# EAGLE design HFT-Module-Arduino_1V0 (EAGLE 7.7.0)

## Sheet 1 of 4: Connectors
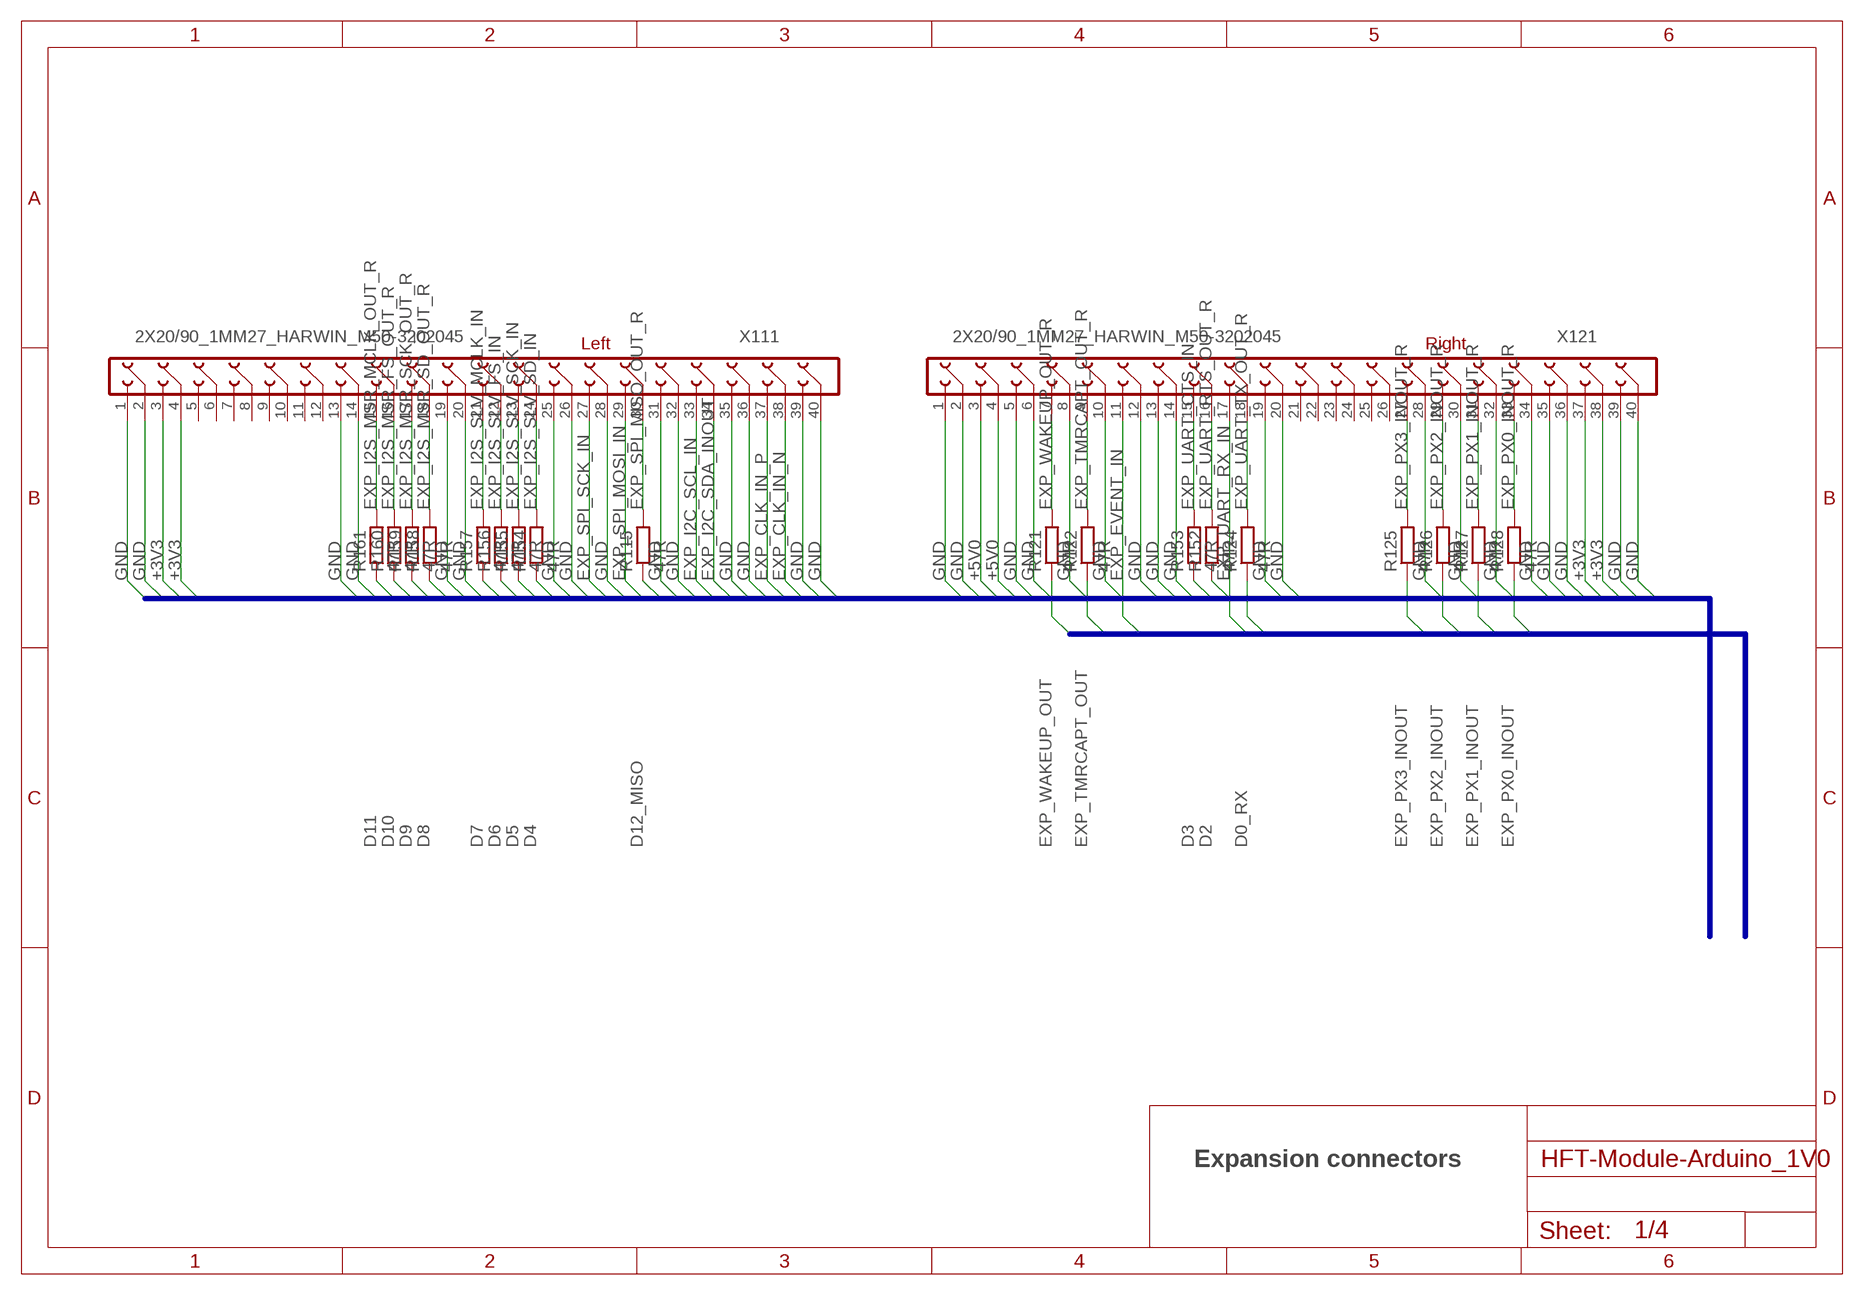
[diagram p0: schematic, sheet 1]

### Parts
R115  47R  R-EU_R0805  [R0805]
R121  47R  R-EU_R0805  [R0805]
R122  47R  R-EU_R0805  [R0805]
R124  47R  R-EU_R0805  [R0805]
R125  47R  R-EU_R0805  [R0805]
R126  47R  R-EU_R0805  [R0805]
R127  47R  R-EU_R0805  [R0805]
R128  47R  R-EU_R0805  [R0805]
R152  47R  R-EU_R0805  [R0805]
R153  47R  R-EU_R0805  [R0805]
R154  47R  R-EU_R0805  [R0805]
R155  47R  R-EU_R0805  [R0805]
R156  47R  R-EU_R0805  [R0805]
R157  47R  R-EU_R0805  [R0805]
R158  47R  R-EU_R0805  [R0805]
R159  47R  R-EU_R0805  [R0805]
R160  47R  R-EU_R0805  [R0805]
R161  47R  R-EU_R0805  [R0805]
X111  2X20/90_1MM27_HARWIN_M50-3202045  [2X20/90_1MM27_HARWIN_M50-3202045]
X121  2X20/90_1MM27_HARWIN_M50-3202045  [2X20/90_1MM27_HARWIN_M50-3202045]

### Nets
+3V3: X111.3 X111.4 X121.37 X121.38 ; also sheet 2,3
+5V0 [pwrA5]: X121.3 X121.4 ; also sheet 2,3
D0_RX: R124.1 ; also sheet 3
D2: R152.1 ; also sheet 2
D3: R153.1 ; also sheet 2
D4: R154.1 ; also sheet 3
D5: R155.1 ; also sheet 3
D6: R156.1 ; also sheet 3
D7: R157.1 ; also sheet 3
D8: R158.1 ; also sheet 3
D9: R159.1 ; also sheet 3
D10: R160.1 ; also sheet 3
D11: R161.1 ; also sheet 2
D12_MISO: R115.1 ; also sheet 3
EXP_CLK_IN_N: X111.38
EXP_CLK_IN_P: X111.37
EXP_EVENT_IN: X121.11 ; also sheet 2
EXP_I2C_SCL_IN: X111.33 ; also sheet 2,3
EXP_I2C_SDA_INOUT: X111.34 ; also sheet 2,3
EXP_I2S_MSR_FS_OUT_R: R160.2 X111.16
EXP_I2S_MSR_MCLK_OUT_R: R161.2 X111.15
EXP_I2S_MSR_SCK_OUT_R: R159.2 X111.17
EXP_I2S_MSR_SD_OUT_R: R158.2 X111.18
EXP_I2S_SLV_FS_IN: R156.2 X111.22
EXP_I2S_SLV_MCLK_IN: R157.2 X111.21
EXP_I2S_SLV_SCK_IN: R155.2 X111.23
EXP_I2S_SLV_SD_IN: R154.2 X111.24
EXP_PX0_INOUT: R128.1 ; also sheet 3
EXP_PX0_INOUT_R: R128.2 X121.33
EXP_PX1_INOUT: R127.1 ; also sheet 3
EXP_PX1_INOUT_R: R127.2 X121.31
EXP_PX2_INOUT: R126.1 ; also sheet 3
EXP_PX2_INOUT_R: R126.2 X121.29
EXP_PX3_INOUT: R125.1 ; also sheet 3
EXP_PX3_INOUT_R: R125.2 X121.27
EXP_SPI_MISO_OUT_R: R115.2 X111.30
EXP_SPI_MOSI_IN: X111.29 ; also sheet 3
EXP_SPI_SCK_IN: X111.27 ; also sheet 3
EXP_TMRCAPT_OUT: R122.1 ; also sheet 2
EXP_TMRCAPT_OUT_R: R122.2 X121.9
EXP_UART_CTS_IN: R153.2 X121.15
EXP_UART_RTS_OUT_R: R152.2 X121.16
EXP_UART_RX_IN: X121.17 ; also sheet 3
EXP_UART_TX_OUT_R: R124.2 X121.18
EXP_WAKEUP_OUT: R121.1 ; also sheet 2
EXP_WAKEUP_OUT_R: R121.2 X121.7
GND: X111.1 X111.2 X111.13 X111.14 X111.19 X111.20 X111.25 X111.26 X111.28 X111.31 X111.32 X111.35 X111.36 X111.39 X111.40 X121.1 X121.2 X121.5 X121.6 X121.8 X121.10 X121.12 X121.13 X121.14 X121.19 X121.20 X121.28 X121.30 X121.32 X121.34 X121.35 X121.36 X121.39 X121.40 ; also sheet 2,3,4
Unconnected: X111.5 X111.6 X111.7 X111.8 X111.9 X111.10 X111.11 X111.12 X121.21 X121.22 X121.23 X121.24 X121.25 X121.26

### Buses
EXP_WAKEUP_OUT,EXP_TMRCAPT_OUT,EXP_EVENT_IN,EXP_UART_TX_OUT,EXP_UART_RX_IN,EXP_UART_CTS_IN,EXP_UART_RTS_OUT,EXP_PX0_INOUT,EXP_PX1_INOUT,EXP_PX2_INOUT,EXP_PX3_INOUT
GND,+3V3,+5V0,EXP_CLK_IN_P,EXP_CLK_IN_N,EXP_I2C_SCL_IN,EXP_I2C_SDA_INOUT,EXP_SPI_SCK_IN,EXP_SPI_MOSI_IN,EXP_SPI_MISO_OUT,EXP_I2S_SLV_SCK_IN,EXP_I2S_SLV_SD_IN,EXP_I2S_SLV_MCLK_IN,EXP_I2S_SLV_FS_IN,EXP_I2S_MSR_SCK_OUT,EXP_I2S_MSR_SD_OUT,EXP_I2S_MSR_MCLK_OUT,EXP_I2S_MSR_FS_OUT,D[2..11]

### Notes on the sheet
- Left | Right
- Expansion connectors

## Sheet 2 of 4: Jumper field
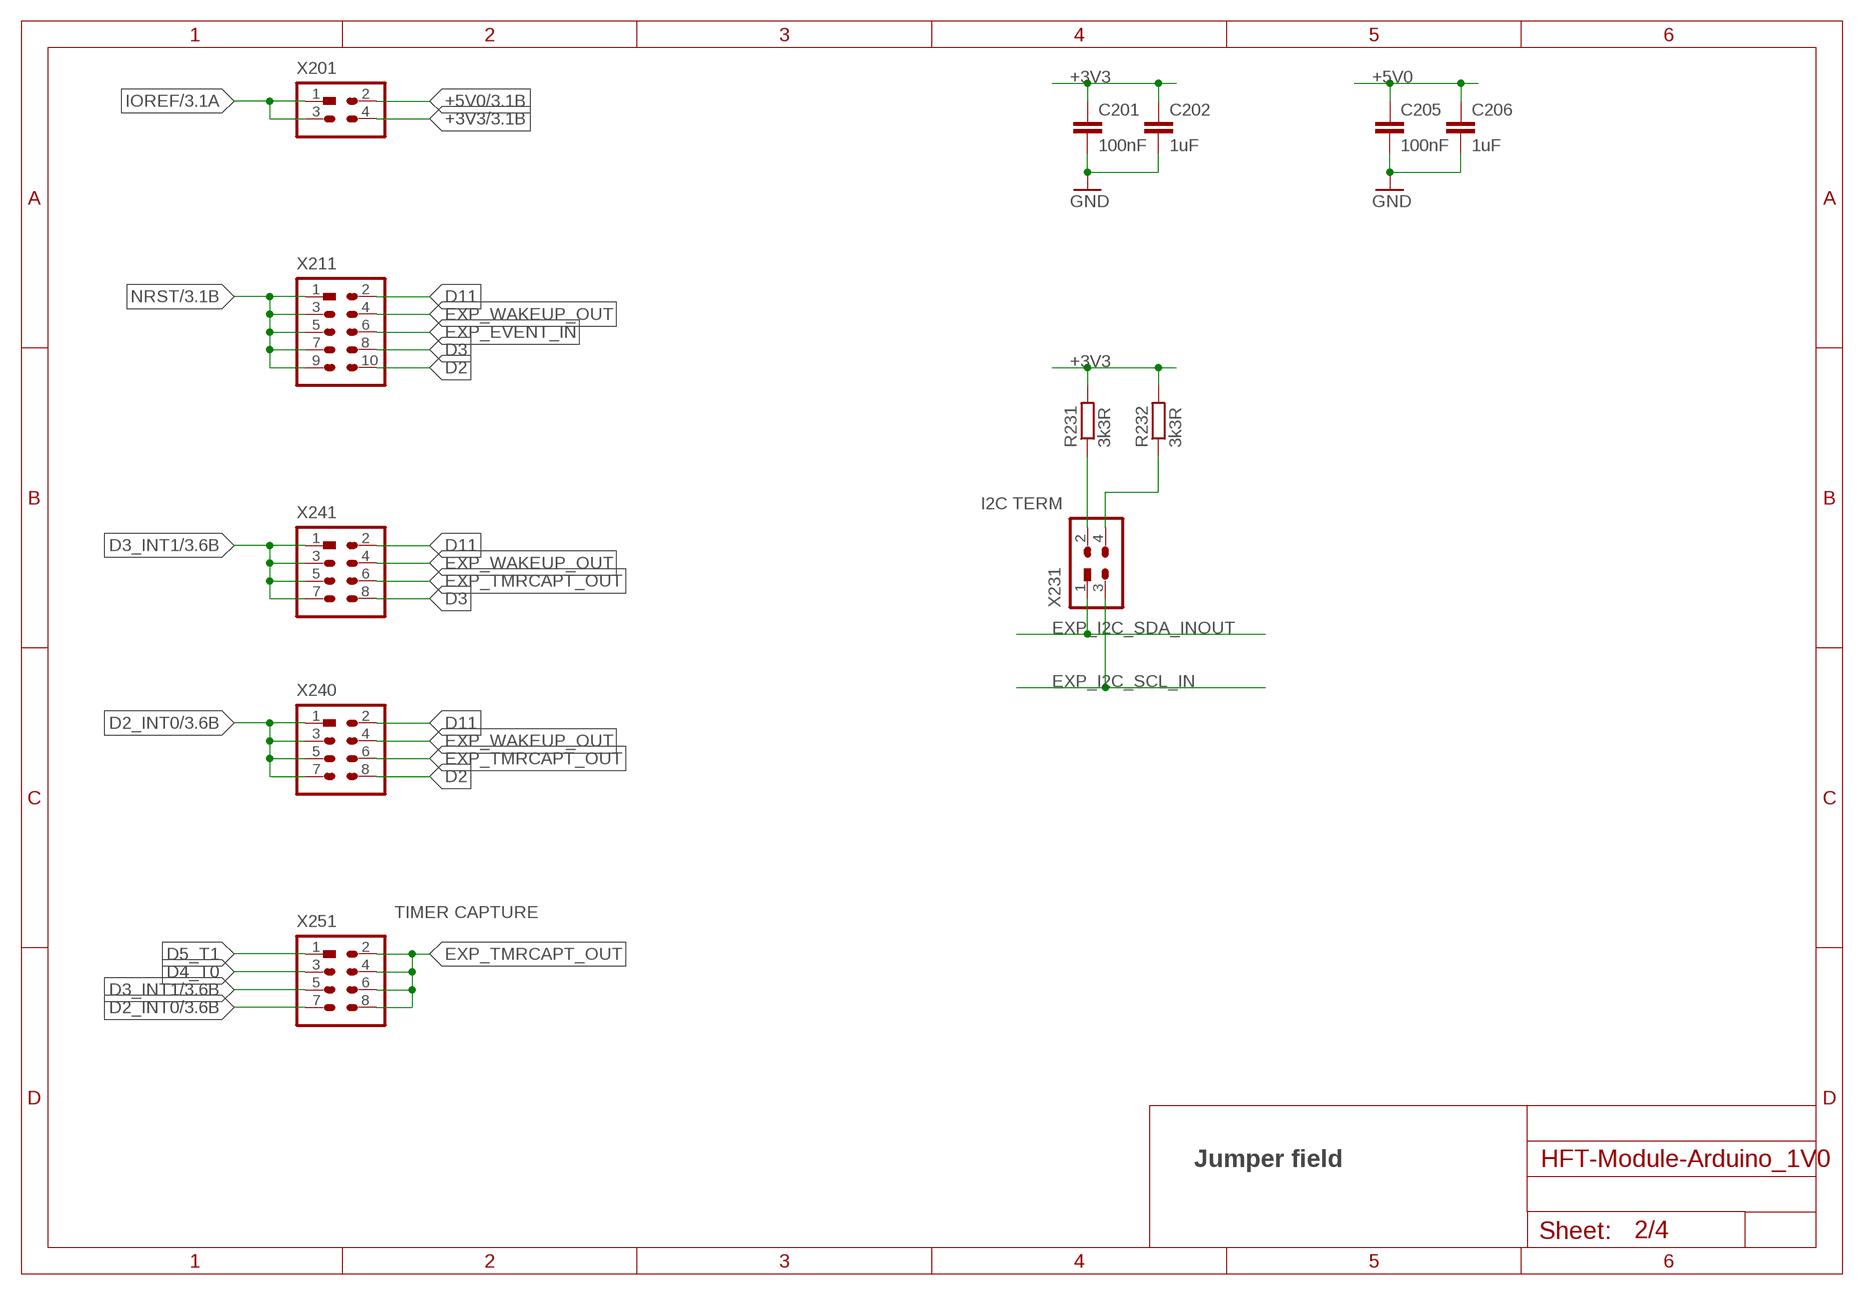
[diagram p1: schematic, sheet 2]

### Parts
C201  100nF  C-EUC0805  [C0805]
C202  1uF  C-EUC0805  [C0805]
C205  100nF  C-EUC0805  [C0805]
C206  1uF  C-EUC0805  [C0805]
R231  3k3R  R-EU_R0805  [R0805]
R232  3k3R  R-EU_R0805  [R0805]
X201  HEADER-2X2  [2X02]
X211  HEADER-2X5  [2X05]
X231  HEADER-2X2  [2X02]
X240  HEADER-2X4  [2X04]
X241  HEADER-2X4  [2X04]
X251  HEADER-2X4  [2X04]

### Nets
+3V3: C201.1 C202.1 R231.2 R232.2 X201.4 ; also sheet 1,3
+5V0 [pwrA5]: C205.1 C206.1 X201.2 ; also sheet 1,3
D2: X211.10 X240.8 ; also sheet 1
D2_INT0: X240.1 X240.3 X240.5 X240.7 X251.7 ; also sheet 3
D3: X211.8 X241.8 ; also sheet 1
D3_INT1: X241.1 X241.3 X241.5 X241.7 X251.5 ; also sheet 3
D4_T0: X251.3 ; also sheet 3
D5_T1: X251.1 ; also sheet 3
D11: X211.2 X240.2 X241.2 ; also sheet 1
EXP_EVENT_IN: X211.6 ; also sheet 1
EXP_I2C_SCL_IN: X231.3 ; also sheet 1,3
EXP_I2C_SDA_INOUT: X231.1 ; also sheet 1,3
EXP_TMRCAPT_OUT: X240.6 X241.6 X251.2 X251.4 X251.6 X251.8 ; also sheet 1
EXP_WAKEUP_OUT: X211.4 X240.4 X241.4 ; also sheet 1
GND: C201.2 C202.2 C205.2 C206.2 ; also sheet 1,3,4
IOREF: X201.1 X201.3 ; also sheet 3
NRST: X211.1 X211.3 X211.5 X211.7 X211.9 ; also sheet 3
SCL_TERM: R232.1 X231.4
SDA_TERM: R231.1 X231.2

### Notes on the sheet
- I2C TERM
- TIMER CAPTURE
- Jumper field

## Sheet 3 of 4: Arduino sockets
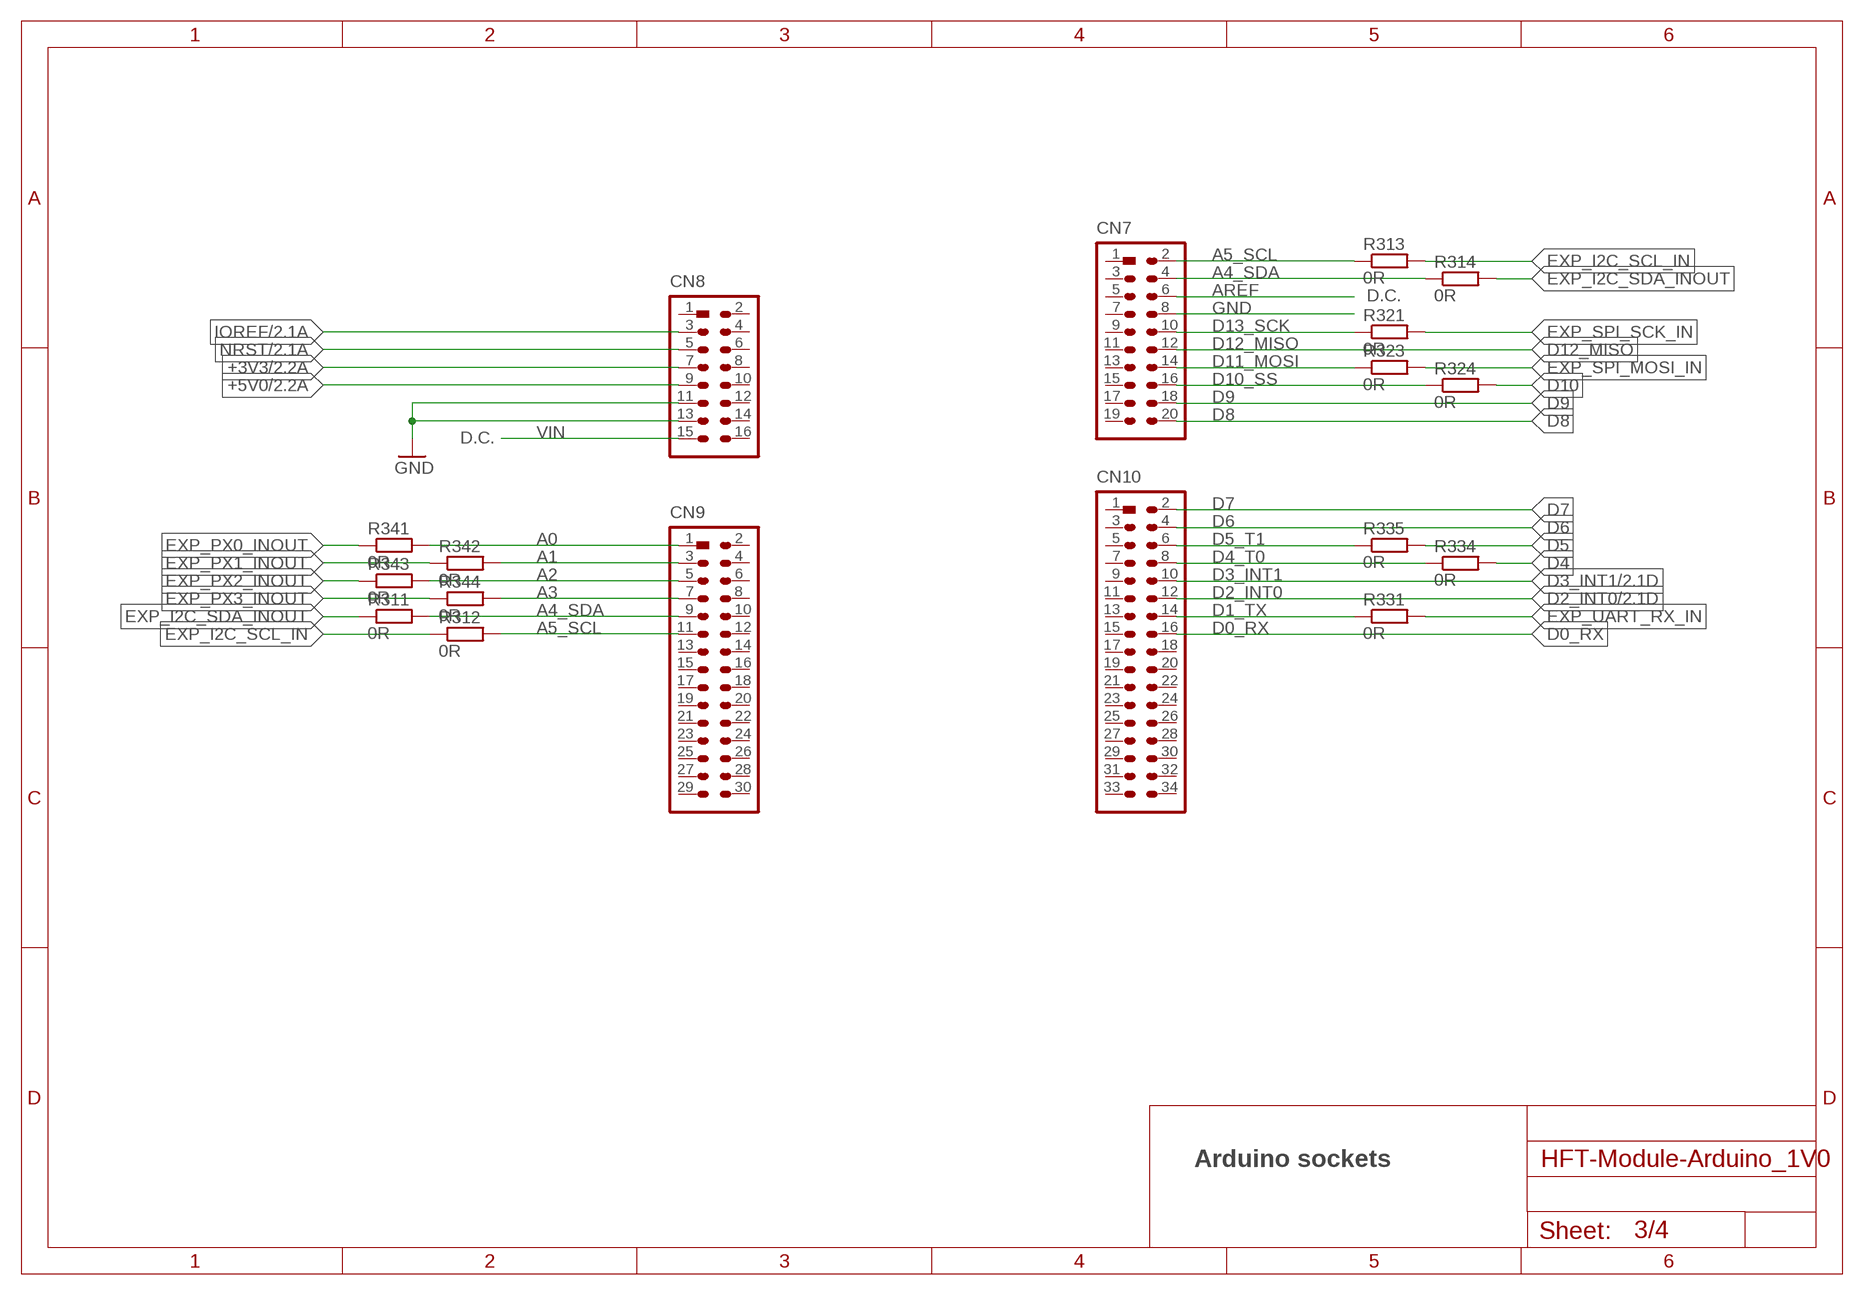
[diagram p2: schematic, sheet 3]

### Parts
CN7  HEADER-2X10  [2X10]
CN8  HEADER-2X8  [2X08]
CN9  HEADER-2X15  [2X15]
CN10  HEADER-2X17  [2X17]
R311  0R  R-EU_R0805  [R0805]
R312  0R  R-EU_R0805  [R0805]
R313  0R  R-EU_R0805  [R0805]
R314  0R  R-EU_R0805  [R0805]
R321  0R  R-EU_R0805  [R0805]
R323  0R  R-EU_R0805  [R0805]
R324  0R  R-EU_R0805  [R0805]
R331  0R  R-EU_R0805  [R0805]
R334  0R  R-EU_R0805  [R0805]
R335  0R  R-EU_R0805  [R0805]
R341  0R  R-EU_R0805  [R0805]
R342  0R  R-EU_R0805  [R0805]
R343  0R  R-EU_R0805  [R0805]
R344  0R  R-EU_R0805  [R0805]

### Nets
+3V3: CN8.7 ; also sheet 1,2
+5V0 [pwrA5]: CN8.9 ; also sheet 1,2
A0: CN9.1 R341.2
A1: CN9.3 R342.2
A2: CN9.5 R343.2
A3: CN9.7 R344.2
A4_SDA: CN7.4 CN9.9 R311.2 R314.1
A5_SCL: CN7.2 CN9.11 R312.2 R313.1
AREF: CN7.6
D0_RX: CN10.16 ; also sheet 1
D1_TX: CN10.14 R331.1
D2_INT0: CN10.12 ; also sheet 2
D3_INT1: CN10.10 ; also sheet 2
D4: R334.2 ; also sheet 1
D4_T0: CN10.8 R334.1 ; also sheet 2
D5: R335.2 ; also sheet 1
D5_T1: CN10.6 R335.1 ; also sheet 2
D6: CN10.4 ; also sheet 1
D7: CN10.2 ; also sheet 1
D8: CN7.20 ; also sheet 1
D9: CN7.18 ; also sheet 1
D10: R324.2 ; also sheet 1
D10_SS: CN7.16 R324.1
D11_MOSI: CN7.14 R323.1
D12_MISO: CN7.12 ; also sheet 1
D13_SCK: CN7.10 R321.1
EXP_I2C_SCL_IN: R312.1 R313.2 ; also sheet 1,2
EXP_I2C_SDA_INOUT: R311.1 R314.2 ; also sheet 1,2
EXP_PX0_INOUT: R341.1 ; also sheet 1
EXP_PX1_INOUT: R342.1 ; also sheet 1
EXP_PX2_INOUT: R343.1 ; also sheet 1
EXP_PX3_INOUT: R344.1 ; also sheet 1
EXP_SPI_MOSI_IN: R323.2 ; also sheet 1
EXP_SPI_SCK_IN: R321.2 ; also sheet 1
EXP_UART_RX_IN: R331.2 ; also sheet 1
GND: CN7.8 CN8.11 CN8.13 ; also sheet 1,2,4
IOREF: CN8.3 ; also sheet 2
NRST: CN8.5 ; also sheet 2
VIN: CN8.15
Unconnected: CN7.1 CN7.3 CN7.5 CN7.7 CN7.9 CN7.11 CN7.13 CN7.15 CN7.17 CN7.19 CN8.1 CN8.2 CN8.4 CN8.6 CN8.8 CN8.10 CN8.12 CN8.14 CN8.16 CN9.2 CN9.4 CN9.6 CN9.8 CN9.10 CN9.12 CN9.13 CN9.14 CN9.15 CN9.16 CN9.17 CN9.18 CN9.19 CN9.20 CN9.21 CN9.22 CN9.23 CN9.24 CN9.25 CN9.26 CN9.27 CN9.28 CN9.29 CN9.30 CN10.1 CN10.3 CN10.5 CN10.7 CN10.9 CN10.11 CN10.13 CN10.15 CN10.17 CN10.18 CN10.19 CN10.20 CN10.21 CN10.22 CN10.23 CN10.24 CN10.25 CN10.26 CN10.27 CN10.28 CN10.29 CN10.30 CN10.31 CN10.32 CN10.33 CN10.34

### Notes on the sheet
- D.C.
- D.C.
- Arduino sockets

## Sheet 4 of 4: Holes
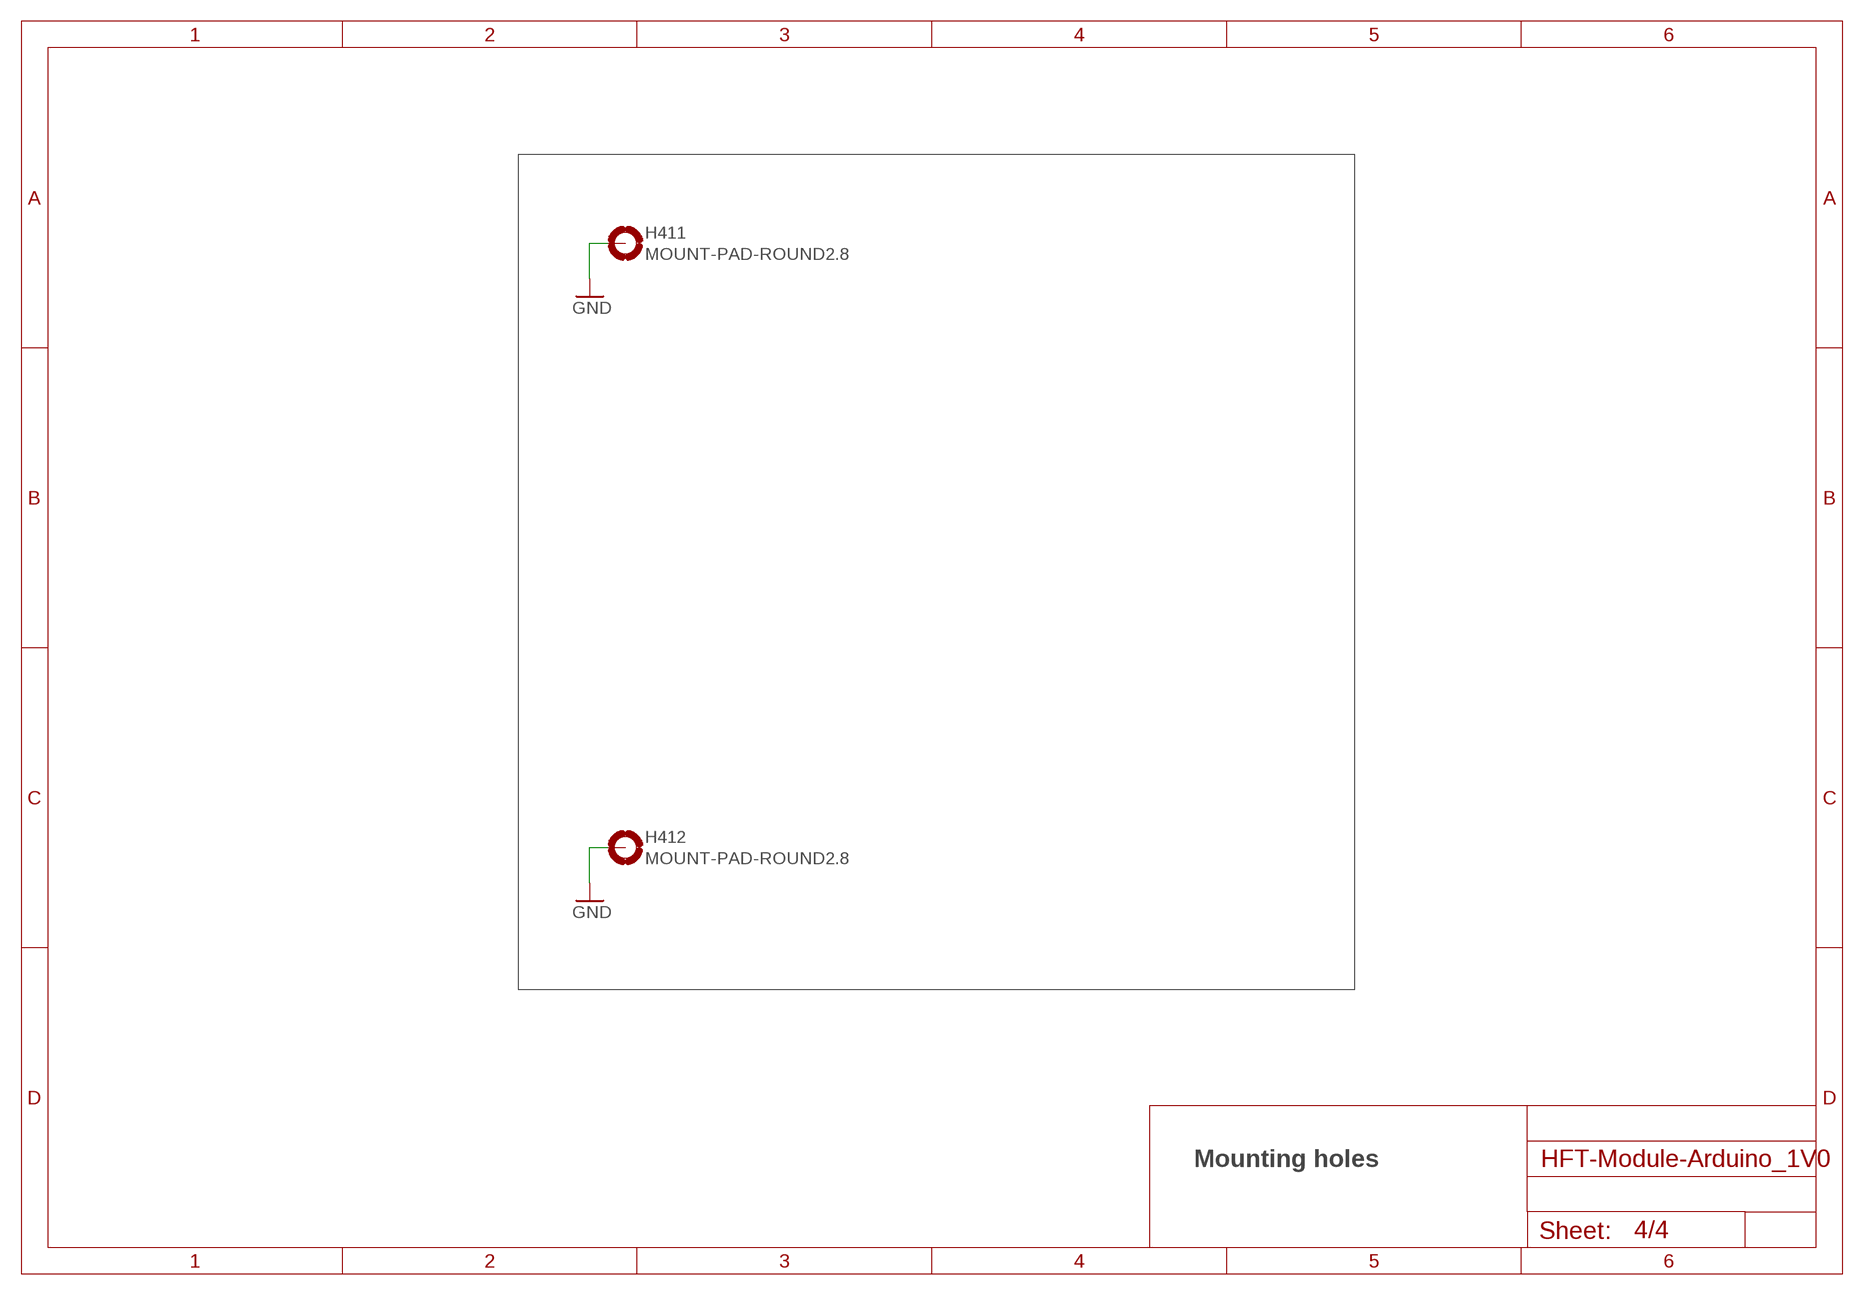
[diagram p3: schematic, sheet 4]

### Parts
H411  MOUNT-PAD-ROUND2.8  [2,8-PAD]
H412  MOUNT-PAD-ROUND2.8  [2,8-PAD]

### Nets
GND: H411.B2,8(MOUNT) H412.B2,8(MOUNT) ; also sheet 1,2,3

### Notes on the sheet
- Mounting holes

## Library data of the parts
C201 C202 C205 C206 = rcl:C-EU: CAPACITOR, European symbol
CN7 = df4iah_connector:HEADER-2X10: Header 2X10 2.54mm
CN8 = df4iah_connector:HEADER-2X8: Header 2X8 2.54mm
CN9 = df4iah_connector:HEADER-2X15: Header 2X15 2.54mm
CN10 = df4iah_connector:HEADER-2X17: Header 2X17 2.54mm
H411 H412 = holes:MOUNT-PAD-ROUND: MOUNTING PAD, round
R115 R121 R122 R124-R128 R152-R161 R231 R232 R311-R314 R321 R323 R324 R331 R334 R335 R341-R344 = rcl:R-EU_: RESISTOR, European symbol
X111 X121 = df4iah_connector:2X20/90_1MM27_HARWIN_M50-3202045: Header 20X2 1.27mm M50-3202045 Archer, 90°
X201 X231 = df4iah_connector:HEADER-2X2: Header 2X2 2.54mm
X211 = df4iah_connector:HEADER-2X5: Header 2X5 2.54mm
X240 X241 X251 = df4iah_connector:HEADER-2X4: Header 2X4 2.54mm

## Net classes
1 pwr_relay: width 1.5 mm, clearance 0.5 mm
2 pwr_ttl: width 0.75 mm, clearance 0.5 mm
4 pwrA5: width 0.4 mm
7 +3V3: clearance 0.5 mm
8 GND: clearance 0.5 mm

## Board
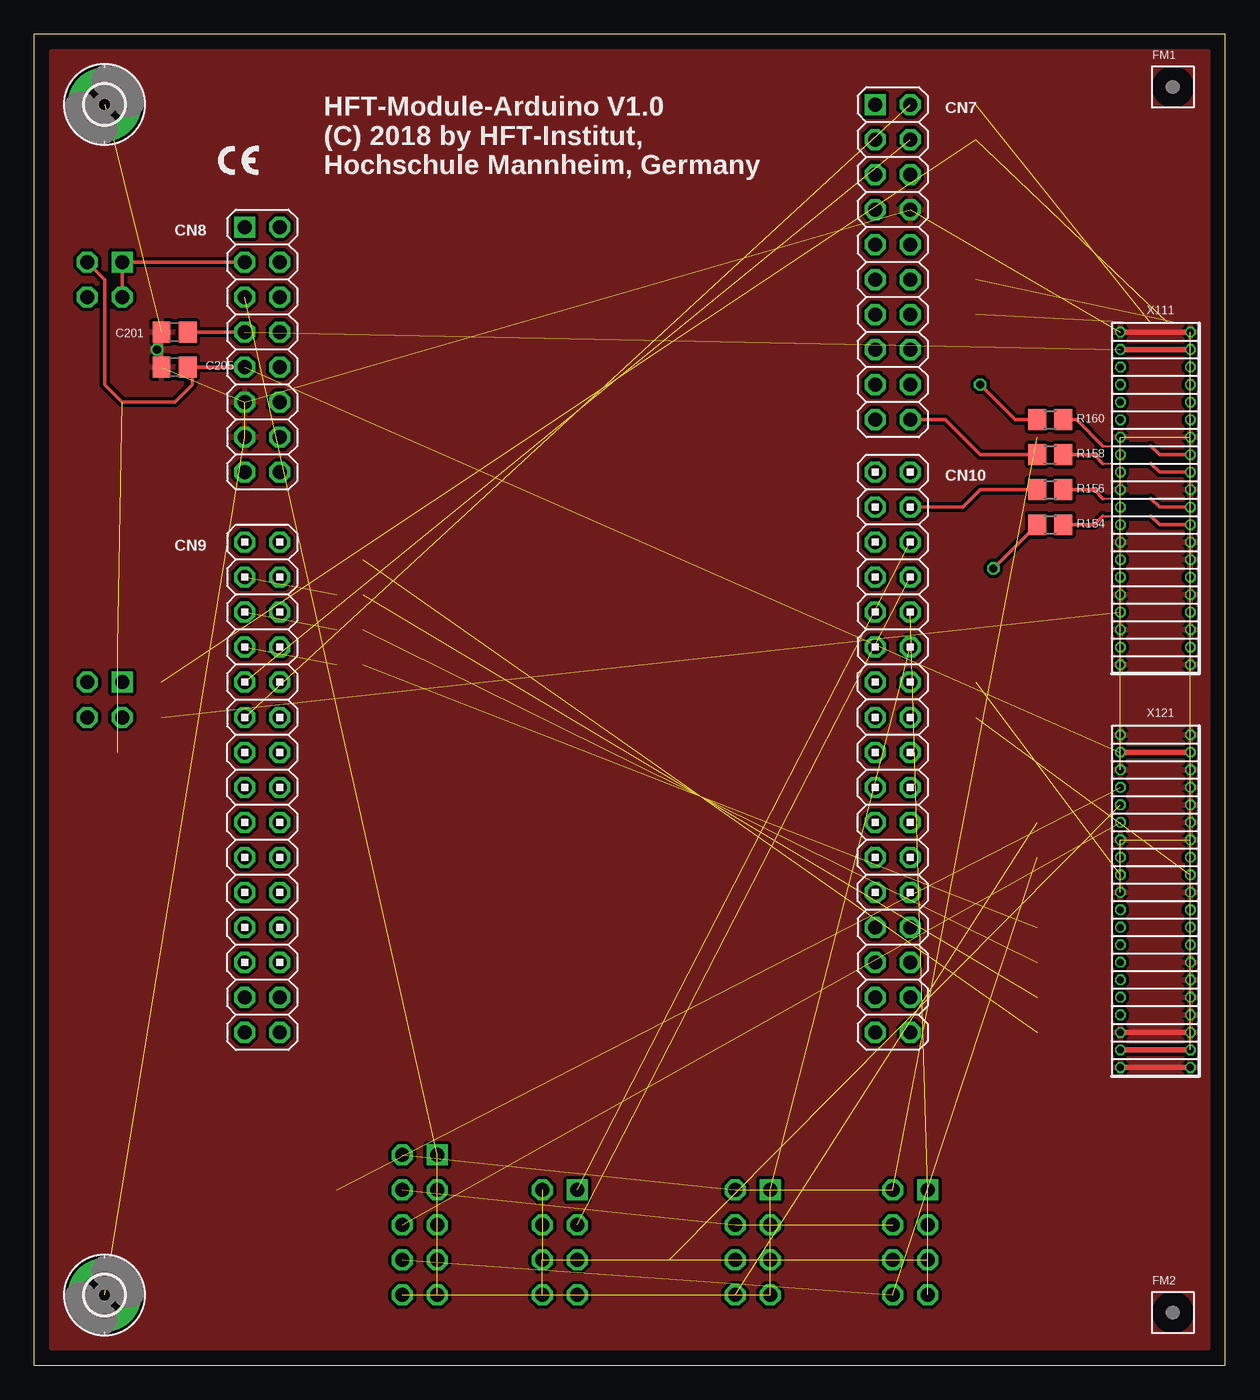
[diagram p4: board, top side]
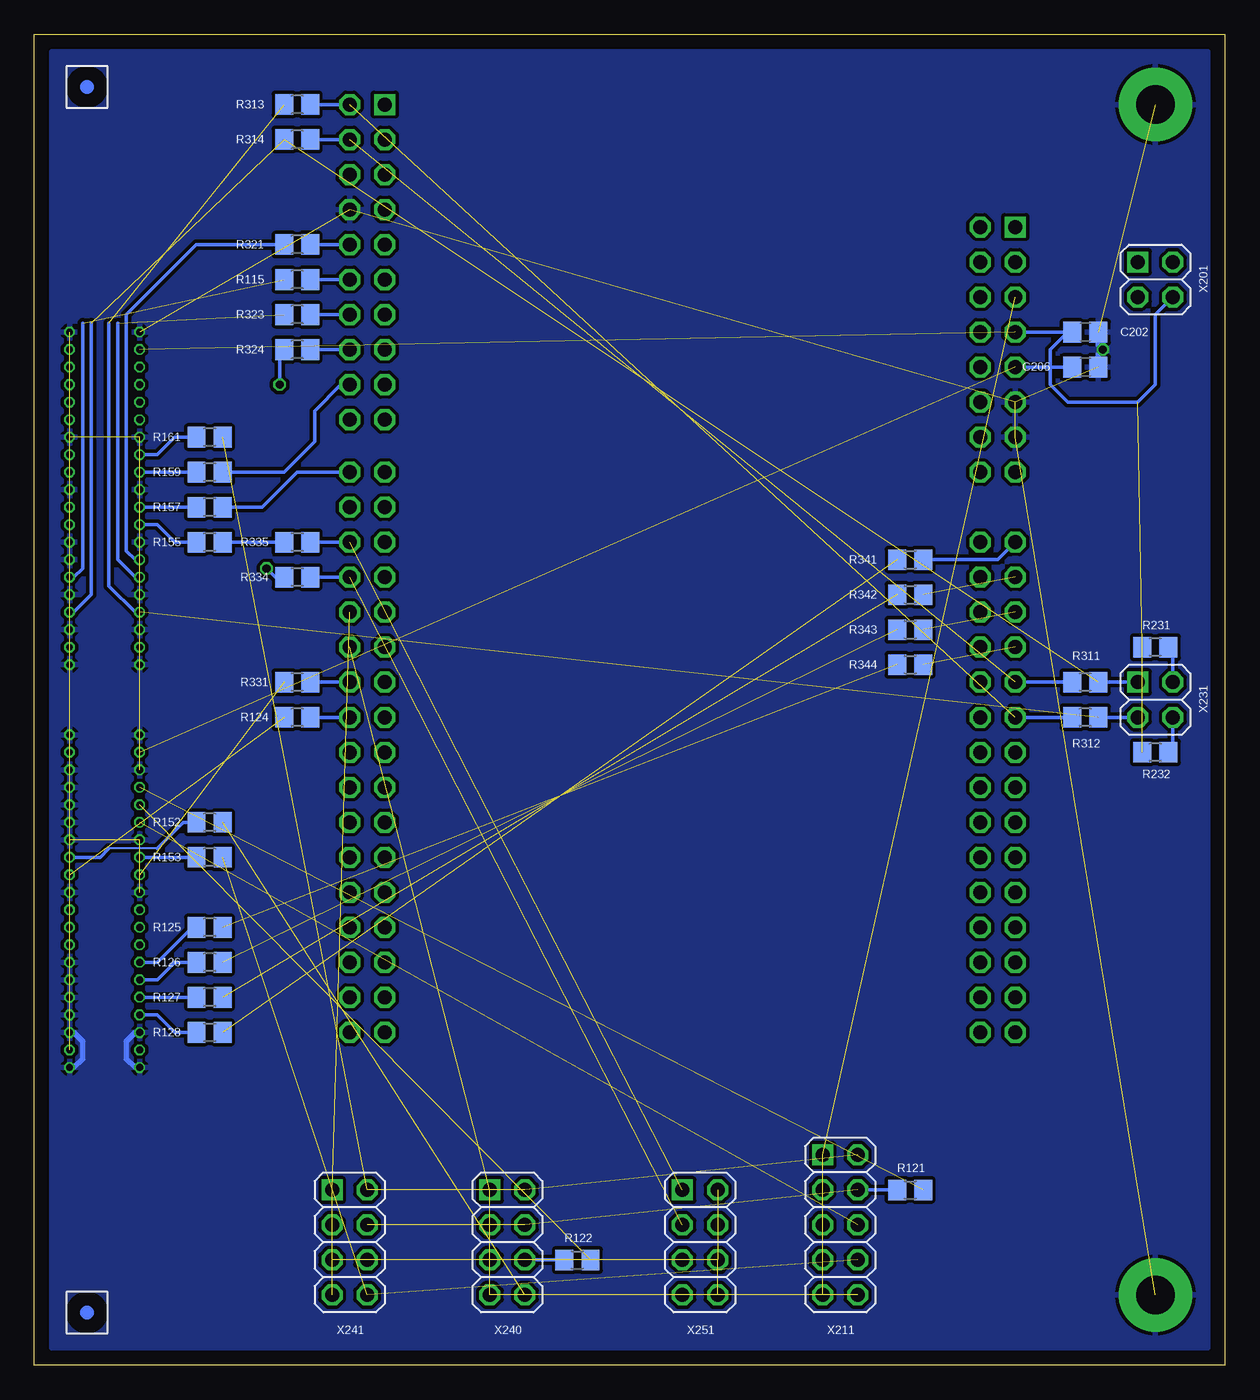
[diagram p5: board, bottom side, seen from below]

Size 86.36 x 96.52 mm. Coordinates in mm from the lower left corner, seen from the top.
Outline: 86.36,96.52 0,96.52 0,0 86.36,0 86.36,96.52
Copper layers ((1*2)+(15*16)): Top 0.035mm / dielectric 0.65mm / Layer_2 0.035mm / dielectric 0.15mm / Layer_15 0.035mm / dielectric 0.65mm / Bottom 0.035mm
Design rules "DirtyPCBs_4layers_6mil_20150401 *": minimum track width 6mil, minimum drill 12mil, track to track 0.25mm, track to pad 0.25mm, pad to pad 6mil, via to via 6mil, smd to smd 0mil, copper to edge 10mil, drill to drill 10mil, minimum pad ring 5mil, minimum via ring 6mil, stop-mask expansion 2mil, vias tented up to drill 25mil, thermal gap 10mil

### Footprints (pad centres in the part's own frame; a part is rotated, then mirrored left to right if it is on the bottom)
C0805 = smd 1.3 x 1.5: 1 -0.95,0; 2 0.95,0
2X10 = drill 1.016 square: 1 -11.43,-1.27 | drill 1.016 octagon: 2 -11.43,1.27; 3 -8.89,-1.27; 4 -8.89,1.27; 5 -6.35,-1.27; 6 -6.35,1.27; 7 -3.81,-1.27; 8 -3.81,1.27; 9 -1.27,-1.27; 10 -1.27,1.27; 11 1.27,-1.27; 12 1.27,1.27; 13 3.81,-1.27; 14 3.81,1.27; 15 6.35,-1.27; 16 6.35,1.27; 17 8.89,-1.27; 18 8.89,1.27; 19 11.43,-1.27; 20 11.43,1.27
2X08 = drill 1.016 square: 1 -8.89,-1.27 | drill 1.016 octagon: 2 -8.89,1.27; 3 -6.35,-1.27; 4 -6.35,1.27; 5 -3.81,-1.27; 6 -3.81,1.27; 7 -1.27,-1.27; 8 -1.27,1.27; 9 1.27,-1.27; 10 1.27,1.27; 11 3.81,-1.27; 12 3.81,1.27; 13 6.35,-1.27; 14 6.35,1.27; 15 8.89,-1.27; 16 8.89,1.27
2X15 = drill 1.016 octagon: 1 -17.78,-1.27; 2 -17.78,1.27; 3 -15.24,-1.27; 4 -15.24,1.27; 5 -12.7,-1.27; 6 -12.7,1.27; 7 -10.16,-1.27; 8 -10.16,1.27; 9 -7.62,-1.27; 10 -7.62,1.27; 11 -5.08,-1.27; 12 -5.08,1.27; 13 -2.54,-1.27; 14 -2.54,1.27; 15 0,-1.27; 16 0,1.27; 17 2.54,-1.27; 18 2.54,1.27; 19 5.08,-1.27; 20 5.08,1.27; 21 7.62,-1.27; 22 7.62,1.27; 23 10.16,-1.27; 24 10.16,1.27; 25 12.7,-1.27; 26 12.7,1.27; 27 15.24,-1.27; 28 15.24,1.27; 29 17.78,-1.27; 30 17.78,1.27
2X17 = drill 1.016 octagon: 1 -20.32,-1.27; 2 -20.32,1.27; 3 -17.78,-1.27; 4 -17.78,1.27; 5 -15.24,-1.27; 6 -15.24,1.27; 7 -12.7,-1.27; 8 -12.7,1.27; 9 -10.16,-1.27; 10 -10.16,1.27; 11 -7.62,-1.27; 12 -7.62,1.27; 13 -5.08,-1.27; 14 -5.08,1.27; 15 -2.54,-1.27; 16 -2.54,1.27; 17 0,-1.27; 18 0,1.27; 19 2.54,-1.27; 20 2.54,1.27; 21 5.08,-1.27; 22 5.08,1.27; 23 7.62,-1.27; 24 7.62,1.27; 25 10.16,-1.27; 26 10.16,1.27; 27 12.7,-1.27; 28 12.7,1.27; 29 15.24,-1.27; 30 15.24,1.27; 31 17.78,-1.27; 32 17.78,1.27; 33 20.32,-1.27; 34 20.32,1.27
2,8-PAD = drill 2.8 pad 5.334: B2,8 0,0
R0805 = smd 1.3 x 1.5: 1 -0.95,0; 2 0.95,0
2X20/90_1MM27_HARWIN_M50-3202045 = drill 0.5 pad 0.762 octagon: 1 -12.7,-2.54; 2 -12.7,2.54; 3 -11.43,-2.54; 4 -11.43,2.54; 5 -10.16,-2.54; 6 -10.16,2.54; 7 -8.89,-2.54; 8 -8.89,2.54; 9 -7.62,-2.54; 10 -7.62,2.54; 11 -6.35,-2.54; 12 -6.35,2.54; 13 -5.08,-2.54; 14 -5.08,2.54; 15 -3.81,-2.54; 16 -3.81,2.54; 17 -2.54,-2.54; 18 -2.54,2.54; 19 -1.27,-2.54; 20 -1.27,2.54; 21 0,-2.54; 22 0,2.54; 23 1.27,-2.54; 24 1.27,2.54; 25 2.54,-2.54; 26 2.54,2.54; 27 3.81,-2.54; 28 3.81,2.54; 29 5.08,-2.54; 30 5.08,2.54; 31 6.35,-2.54; 32 6.35,2.54; 33 7.62,-2.54; 34 7.62,2.54; 35 8.89,-2.54; 36 8.89,2.54; 37 10.16,-2.54; 38 10.16,2.54; 39 11.43,-2.54; 40 11.43,2.54
2X02 = drill 1.016 square: 1 -1.27,-1.27 | drill 1.016 octagon: 2 -1.27,1.27; 3 1.27,-1.27; 4 1.27,1.27
2X05 = drill 1.016 square: 1 -5.08,-1.27 | drill 1.016 octagon: 2 -5.08,1.27; 3 -2.54,-1.27; 4 -2.54,1.27; 5 0,-1.27; 6 0,1.27; 7 2.54,-1.27; 8 2.54,1.27; 9 5.08,-1.27; 10 5.08,1.27
2X04 = drill 1.016 square: 1 -3.81,-1.27 | drill 1.016 octagon: 2 -3.81,1.27; 3 -1.27,-1.27; 4 -1.27,1.27; 5 1.27,-1.27; 6 1.27,1.27; 7 3.81,-1.27; 8 3.81,1.27

### Placement (x,y rotation side)
C201  10.16,74.93 180 top
C202  10.16,74.93 0 bottom
C205  10.16,72.39 180 top
C206  10.16,72.39 0 bottom
CN7  62.23,80.01 270 top
CN8  16.51,73.66 270 top
CN9  16.51,41.91 270 top
CN10  62.23,44.45 270 top
FM1  [FIDUCIAL_MARK_1MM]  82.55,92.71 0 top
FM2  [FIDUCIAL_MARK_1MM]  82.55,3.81 0 top
H411  5.08,5.08 180 top
H412  5.08,91.44 180 top
R115  67.31,78.74 180 bottom
R121  22.86,12.7 0 bottom
R122  46.99,7.62 0 bottom
R124  67.31,46.99 180 bottom
R125  73.66,31.75 180 bottom
R126  73.66,29.21 180 bottom
R127  73.66,26.67 180 bottom
R128  73.66,24.13 180 bottom
R152  73.66,39.37 180 bottom
R153  73.66,36.83 180 bottom
R154  73.66,60.96 0 top
R155  73.66,59.69 180 bottom
R156  73.66,63.5 0 top
R157  73.66,62.23 180 bottom
R158  73.66,66.04 0 top
R159  73.66,64.77 180 bottom
R160  73.66,68.58 0 top
R161  73.66,67.31 180 bottom
R231  5.08,52.07 180 bottom
R232  5.08,44.45 180 bottom
R311  10.16,49.53 180 bottom
R312  10.16,46.99 180 bottom
R313  67.31,91.44 180 bottom
R314  67.31,88.9 180 bottom
R321  67.31,81.28 180 bottom
R323  67.31,76.2 180 bottom
R324  67.31,73.66 180 bottom
R331  67.31,49.53 180 bottom
R334  67.31,57.15 180 bottom
R335  67.31,59.69 180 bottom
R341  22.86,58.42 0 bottom
R342  22.86,55.88 0 bottom
R343  22.86,53.34 0 bottom
R344  22.86,50.8 0 bottom
X111  81.28,62.23 270 top
X121  81.28,33.02 270 top
X201  5.08,78.74 270 bottom
X211  27.94,10.16 270 bottom
X231  5.08,48.26 270 bottom
X240  52.07,8.89 270 bottom
X241  63.5,8.89 270 bottom
X251  38.1,8.89 270 bottom

### Tracks (layer width: path | path; a pad name or v marks a point on that pad's centre or on a via)
+3V3  (4 unrouted)
  Top 0.254: C202.1 CN8.7
  Top 0.406: X111.3 X111.4 | X121.37 X121.38
  Bottom 0.254: CN8.7 C202.1 | 11.43,74.93 12.7,73.66 12.7,71.12 11.43,69.85 6.35,69.85 5.08,71.12 5.08,76.2 X201.4
  Bottom 0.406: C202.1 11.43,74.93
+5V0  (1 unrouted)
  Top 0.254: C206.1 CN8.9 | 11.43,72.39 11.43,71.12 10.16,69.85 6.35,69.85 5.08,71.12 5.08,78.74 X201.2
  Top 0.406: C206.1 11.43,72.39 | X121.3 X121.4
  Bottom 0.254: CN8.9 C206.1
A0
  Bottom 0.254: CN9.1 16.51,58.42 R341.2
A1  (1 unrouted)
A2  (1 unrouted)
A3  (1 unrouted)
A4_SDA  (1 unrouted)
  Bottom 0.254: R311.2 CN9.9 | CN7.4 R314.1
A5_SCL  (1 unrouted)
  Bottom 0.254: R312.2 CN9.11 | CN7.2 R313.1
D0_RX
  Bottom 0.254: CN10.16 R124.1
D1_TX
  Bottom 0.254: CN10.14 R331.1
D2  (2 unrouted)
D2_INT0  (5 unrouted)
D3  (2 unrouted)
D3_INT1  (5 unrouted)
D4  (via drill 0.6)
  Top 0.254: R154.1 v69.53,57.78
  Bottom 0.254: R334.2 68.9,57.15 v69.53,57.78
D4_T0  (1 unrouted)
  Bottom 0.254: CN10.8 R334.1
D5
  Bottom 0.254: R335.2 R155.1
D5_T1  (1 unrouted)
  Bottom 0.254: CN10.6 R335.1
D6
  Top 0.254: R156.1 68.58,63.5 67.31,62.23 CN10.4
D7
  Bottom 0.254: R157.1 69.85,62.23 67.31,64.77 CN10.2
D8
  Top 0.254: R158.1 68.58,66.04 66.04,68.58 CN7.20
D9
  Bottom 0.254: R159.1 68.26,64.77 66.04,66.99 66.04,69.22 64.14,71.12 CN7.18
D10  (via drill 0.6)
  Top 0.254: R160.1 71.12,68.58 v68.58,71.12
  Bottom 0.254: v68.58,71.12 68.58,73.34 R324.2
D10_SS
  Bottom 0.254: CN7.16 R324.1
D11  (3 unrouted)
D11_MOSI
  Bottom 0.254: CN7.14 R323.1
D12_MISO
  Bottom 0.254: CN7.12 R115.1
D13_SCK
  Bottom 0.254: CN7.10 R321.1
EXP_EVENT_IN  (1 unrouted)
EXP_I2C_SCL_IN  (2 unrouted)
  Bottom 0.254: X231.3 R312.1 | X111.33 79.06,54.61 80.96,56.52 80.96,75.56
EXP_I2C_SDA_INOUT  (2 unrouted)
  Bottom 0.254: X231.1 R311.1 | X111.34 83.5,54.61 82.23,55.88 82.23,75.56
EXP_I2S_MSR_FS_OUT_R
  Top 0.152: 77.47,66.67 80.96,66.67
  Top 0.254: R160.2 75.56,68.58 77.47,66.67 | 80.96,66.67 81.6,66.04 X111.16
EXP_I2S_MSR_MCLK_OUT_R
  Bottom 0.254: R161.2 76.2,67.31 77.47,66.04 X111.15
EXP_I2S_MSR_SCK_OUT_R
  Bottom 0.254: R159.2 X111.17
EXP_I2S_MSR_SD_OUT_R
  Top 0.152: 77.47,65.41 80.96,65.41
  Top 0.254: R158.2 76.83,66.04 77.47,65.41 | 80.96,65.41 81.6,64.77 X111.18
EXP_I2S_SLV_FS_IN
  Top 0.152: 77.47,62.87 80.96,62.87
  Top 0.254: R156.2 76.83,63.5 77.47,62.87 | 80.96,62.87 81.6,62.23 X111.22
EXP_I2S_SLV_MCLK_IN
  Bottom 0.254: R157.2 X111.21
EXP_I2S_SLV_SCK_IN
  Bottom 0.254: R155.2 76.2,59.69 77.47,60.96 X111.23
EXP_I2S_SLV_SD_IN
  Top 0.152: 77.47,61.59 80.96,61.59
  Top 0.254: R154.2 76.83,60.96 77.47,61.59 | 80.96,61.59 81.6,60.96 X111.24
EXP_PX0_INOUT  (1 unrouted)
EXP_PX0_INOUT_R
  Bottom 0.254: R128.2 76.2,24.13 77.47,25.4 X121.33
EXP_PX1_INOUT  (1 unrouted)
EXP_PX1_INOUT_R
  Bottom 0.254: R127.2 X121.31
EXP_PX2_INOUT  (1 unrouted)
EXP_PX2_INOUT_R
  Bottom 0.254: R126.2 76.2,29.21 77.47,27.94 X121.29
EXP_PX3_INOUT  (1 unrouted)
EXP_PX3_INOUT_R
  Bottom 0.254: R125.2 74.93,31.75 77.47,29.21 X121.27
EXP_SPI_MISO_OUT_R  (1 unrouted)
  Bottom 0.254: X111.30 83.5,57.15 82.87,57.78 82.87,75.56
EXP_SPI_MOSI_IN  (1 unrouted)
  Bottom 0.254: 80.33,75.56 80.33,58.42 79.06,57.15 X111.29
EXP_SPI_SCK_IN
  Bottom 0.254: X111.27 79.06,58.42 79.69,59.05 79.69,76.2 74.61,81.28 R321.2
EXP_TMRCAPT_OUT  (5 unrouted)
  Bottom 0.254: R122.1 X240.6
EXP_TMRCAPT_OUT_R  (1 unrouted)
EXP_UART_CTS_IN
  Bottom 0.254: R153.2 X121.15
EXP_UART_RTS_OUT_R
  Bottom 0.152: 77.47,37.47 80.96,37.47
  Bottom 0.254: R152.2 75.56,39.37 77.47,37.47 | 80.96,37.47 81.6,36.83 X121.16
EXP_UART_RX_IN  (1 unrouted)
EXP_UART_TX_OUT_R  (1 unrouted)
EXP_WAKEUP_OUT  (2 unrouted)
  Bottom 0.254: R121.1 X211.4
EXP_WAKEUP_OUT_R  (1 unrouted)
GND  (via drill 0.6)  (35 unrouted)
  Top 0.254: C202.2 9.21,73.98 arc-90 v8.89,73.66 arc-90 9.21,73.34 C206.2
  Top 0.406: X111.1 X111.2 | X121.35 X121.36 | X121.39 X121.40
  Bottom 0.254: 9.21,73.98 v8.89,73.66 9.21,73.34
  Bottom 0.406: 9.21,73.98 C202.2 | 9.21,73.34 C206.2 | X121.35 79.06,24.13 79.69,23.5 79.69,22.23 79.06,21.59 X121.39 | X121.40 83.5,21.59 82.87,22.23 82.87,23.5 83.5,24.13 X121.36
  pour Top: 1.27,1.27 1.27,95.25 85.09,95.25 85.09,1.27
  pour Bottom: 1.27,1.27 1.27,95.25 85.09,95.25 85.09,1.27
IOREF
  Top 0.254: CN8.3 X201.1 X201.3
NRST  (5 unrouted)
SCL_TERM
  Bottom 0.254: 3.81,44.45 X231.4
  Bottom 0.406: R232.1 3.81,44.45
SDA_TERM
  Bottom 0.254: 3.81,52.07 X231.2
  Bottom 0.406: R231.1 3.81,52.07

### Text on the board
tPlace: HFT-Module-Arduino V1.0 / (C) 2018 by HFT-Institut, / Hochschule Mannheim, Germany
tDocu: 3.5 mm / 2 for each board | 2x 2.8 mm